# EAGLE design CAN_Wake_Up (EAGLE 9.1.1)
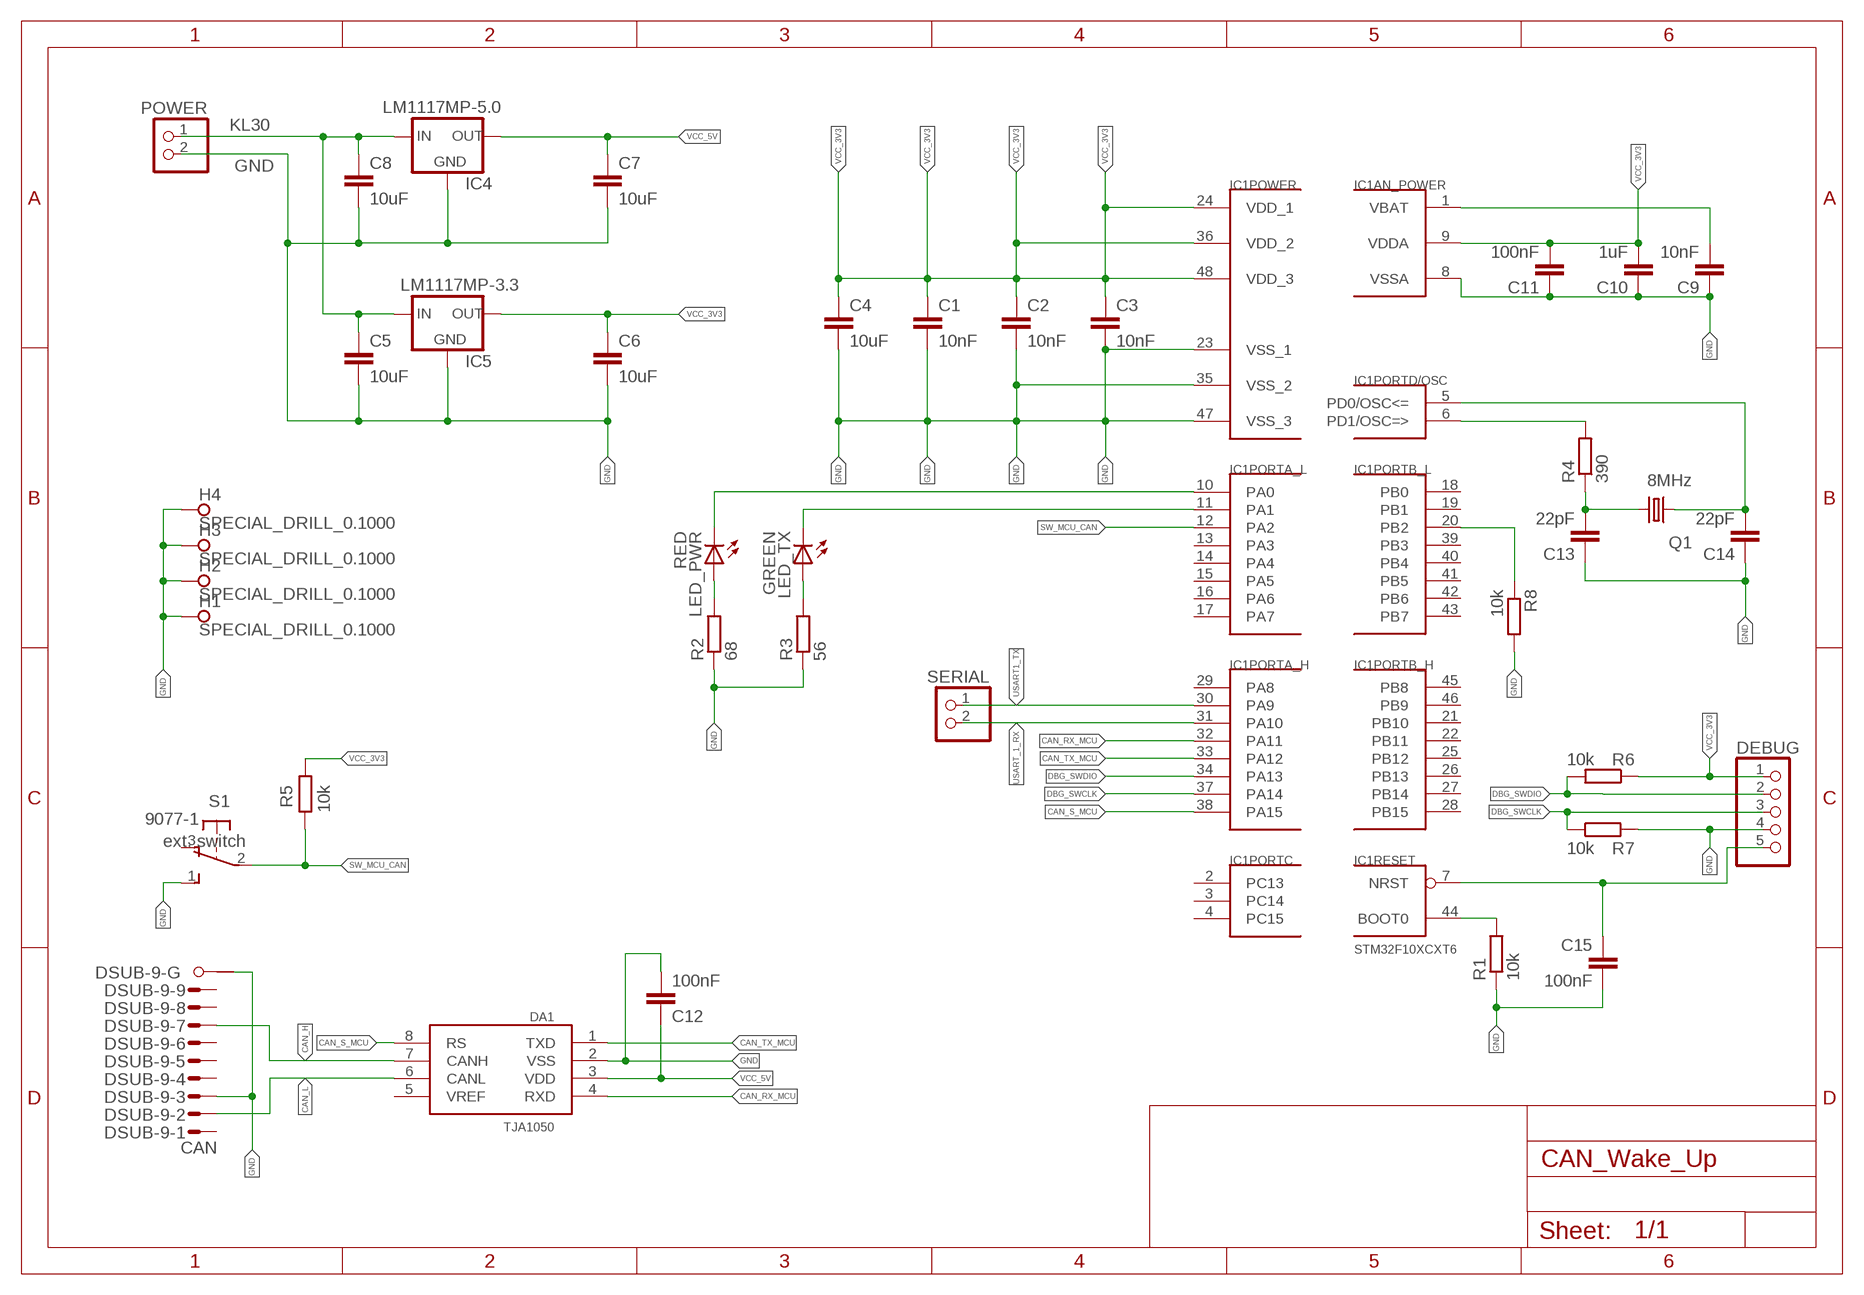
[diagram p0: schematic, sheet 1]

## Parts
C1  10nF  C-EUC0805  [C0805]
C2  10nF  C-EUC0805  [C0805]
C3  10nF  C-EUC0805  [C0805]
C4  10uF  C-EUC0805  [C0805]
C5  10uF  C-EUC0805  [C0805]
C6  10uF  C-EUC0805  [C0805]
C7  10uF  C-EUC0805  [C0805]
C8  10uF  C-EUC0805  [C0805]
C9  10nF  C-EUC0805  [C0805]
C10  1uF  C-EUC0805  [C0805]
C11  100nF  C-EUC0805  [C0805]
C12  100nF  C-EUC0805  [C0805]
C13  22pF  C-EUC0805  [C0805]
C14  22pF  C-EUC0805  [C0805]
C15  100nF  C-EUC0805  [C0805]
DA1  TJA1050  [SO08]
DEBUG  PINHD-1X5  [1X05]
DSUB-9  CAN  M09HPS  [M09HP]
H1  SPECIAL_DRILL_0.1000  [PAD_0.1000]
H2  SPECIAL_DRILL_0.1000  [PAD_0.1000]
H3  SPECIAL_DRILL_0.1000  [PAD_0.1000]
H4  SPECIAL_DRILL_0.1000  [PAD_0.1000]
IC1  STM32F10XCXT6  [TQFP48]
IC4  LM1117MP-5.0  [SOT223]
IC5  LM1117MP-3.3  [SOT223]
LED_PWR  RED  LEDSML0805  [SML0805]
LED_TX  GREEN  LEDSML0805  [SML0805]
POWER  PINHD-1X2  [1X02]
Q1  8MHz  CRYSTALHC49UP  [HC49UP]
R1  10k  R-EU_R0805  [R0805]
R2  68  R-EU_R0805  [R0805]
R3  56  R-EU_R0805  [R0805]
R4  390  R-EU_R0805  [R0805]
R5  10k  R-EU_R0805  [R0805]
R6  10k  R-EU_R0805  [R0805]
R7  10k  R-EU_R0805  [R0805]
R8  10k  R-EU_R0805  [R0805]
S1  9077-1  [9077-1]
SERIAL  PINHD-1X2  [1X02]

## Nets
CAN_H: DA1.7(CANH) DSUB-9.7(-7:M)
CAN_L: DA1.6(CANL) DSUB-9.2(-2:M)
CAN_RX_MCU: DA1.4(RXD) IC1.32(PORTA_H:PA11)
CAN_S_MCU: DA1.8(RS) IC1.38(PORTA_H:PA15)
CAN_TX_MCU: DA1.1(TXD) IC1.33(PORTA_H:PA12)
DBG_SWCLK: DEBUG.3 IC1.37(PORTA_H:PA14) R7.1
DBG_SWDIO: DEBUG.2 IC1.34(PORTA_H:PA13) R6.2
GND: C1.2 C2.2 C3.2 C4.2 C5.2 C6.2 C7.2 C8.2 C9.1 C10.1 C11.1 C12.2 C13.1 C14.1 C15.2 DA1.2(VSS) DEBUG.4 DSUB-9.3(-3:M) DSUB-9.G1(-G:G1) H1.1 H2.1 H3.1 H4.1 IC1.8(AN_POWER:VSSA) IC1.23(POWER:VSS_1) IC1.35(POWER:VSS_2) IC1.47(POWER:VSS_3) IC4.1(GND) IC5.1(GND) POWER.2 R1.1 R2.1 R3.1 R7.2 R8.2 S1.1(S)
KL30: C5.1 C8.1 IC4.3(IN) IC5.3(IN) POWER.1
LED_MCU_CAN: IC1.11(PORTA_L:PA1) LED_TX.C
LED_MCU_PWR: IC1.10(PORTA_L:PA0) LED_PWR.C
N$1: IC1.44(RESET:BOOT0) R1.2
N$2: C9.2 IC1.1(AN_POWER:VBAT)
N$3: LED_PWR.A R2.2
N$4: LED_TX.A R3.2
N$5: C13.2 Q1.2 R4.1
N$6: C14.2 IC1.5(PORTD/OSC:PD0/OSC<=) Q1.1
N$7: IC1.6(PORTD/OSC:PD1/OSC=>) R4.2
N$8: IC1.20(PORTB_L:PB2) R8.1
N$9: C15.1 DEBUG.5 IC1.7(RESET:NRST)
SW_MCU_CAN: IC1.12(PORTA_L:PA2) R5.1 S1.2(P)
USART1_TX: IC1.30(PORTA_H:PA9) SERIAL.1
USART_1_RX: IC1.31(PORTA_H:PA10) SERIAL.2
VCC_3V3: C1.1 C2.1 C3.1 C4.1 C6.1 C10.2 C11.2 DEBUG.1 IC1.9(AN_POWER:VDDA) IC1.24(POWER:VDD_1) IC1.36(POWER:VDD_2) IC1.48(POWER:VDD_3) IC5.2(OUT) IC5.4(OUT) R5.2 R6.1
VCC_5V: C7.1 C12.1 DA1.3(VDD) IC4.2(OUT) IC4.4(OUT)
Unconnected: DA1.5(VREF) DSUB-9.1(-1:M) DSUB-9.4(-4:M) DSUB-9.5(-5:M) DSUB-9.6(-6:M) DSUB-9.8(-8:M) DSUB-9.9(-9:M) DSUB-9.G2(-G:G2) IC1.2(PORTC:PC13) IC1.3(PORTC:PC14) IC1.4(PORTC:PC15) IC1.13(PORTA_L:PA3) IC1.14(PORTA_L:PA4) IC1.15(PORTA_L:PA5) IC1.16(PORTA_L:PA6) IC1.17(PORTA_L:PA7) IC1.18(PORTB_L:PB0) IC1.19(PORTB_L:PB1) IC1.21(PORTB_H:PB10) IC1.22(PORTB_H:PB11) IC1.25(PORTB_H:PB12) IC1.26(PORTB_H:PB13) IC1.27(PORTB_H:PB14) IC1.28(PORTB_H:PB15) IC1.29(PORTA_H:PA8) IC1.39(PORTB_L:PB3) IC1.40(PORTB_L:PB4) IC1.41(PORTB_L:PB5) IC1.42(PORTB_L:PB6) IC1.43(PORTB_L:PB7) IC1.45(PORTB_H:PB8) IC1.46(PORTB_H:PB9) S1.3(O)

## Notes on the sheet
- ext. switch

## Library data of the parts
C1-C15 = rcl:C-EU: CAPACITOR, European symbol
DA1 = CAN_Driver:TJA1050: High speed CAN transceiver Input levels compatible with 3.3 V and 5 V devices 5V supply
DEBUG = pinhead:PINHD-1X5: PIN HEADER
DSUB-9 = con-subd:M09HPS: SUB-D; OC_FARNELL: unknown; OC_NEWARK: unknown
H1-H4 = special-drill:SPECIAL_DRILL_: Special drills
IC1 = stm32:STM32F10XCXT6: ST STM32F101/103 48pin LQFP
IC4 = lm1117_11:LM1117?-*: 800mA Low-Dropout Linear Regulator Source: http://www.ti.com/lit/ds/symlink/lm1117-n.pdf; MF: Texas Instruments; MPN: LM1117MP-5.0; OC_FARNELL: 9778209; OC_NEWARK: 28X3417
IC5 = lm1117_11:LM1117?-*: 800mA Low-Dropout Linear Regulator Source: http://www.ti.com/lit/ds/symlink/lm1117-n.pdf; MF: Texas Instruments; MPN: LM1117MP-3.3; OC_FARNELL: 9778195; OC_NEWARK: 28X3416
LED_PWR LED_TX = led:LED: LED OSRAM: - CHIPLED LG R971, LG N971, LY N971, LG Q971, LY Q971, LO R971, LY R971 LH N974, LH R974 LS Q976, LO Q976, LY Q976 LO Q996 - Hyper CHIPLED LW Q18S LB Q993, LB Q99A, LB R99A - SideLED LS A670, LO A670, LY A670, LG A670, LP A670 LB A673, LV A673, LT A673, LW A673 LH A674 LY A675 LS A676, LA A676, LO A676, LY A676, LW A676 LS A679, LY A679, LG A679 - Hyper Micro SIDELED® LS Y876, LA Y876, LO Y876, LY Y876 LT Y87S - SmartLED LW L88C, LW L88S LB L89C, LB L89S, LG L890 LS L89K, LO L89K, LY L89K LS L896, LA L896, LO L896, LY L896 - TOPLED LS T670, LO T670, LY T670, LG T670, LP T670 LSG T670, LSP T670, LSY T670, LOP T670, LYG T670 LG T671, LOG T671, LSG T671 LB T673, LV T673, LT T673, LW T673 LH T674 LS T676, LA T676, LO T676, LY T676, LB T676, LH T676, LSB T676, LW T676 LB T67C, LV T67C, LT T67C, LS T67K, LO T67K, LY T67K, LW E67C LS E67B, LA E67B, LO E67B, LY E67B, LB E67C, LV E67C, LT E67C LW T67C LS T679, LY T679, LG T679 LS T770, LO T770, LY T770, LG T770, LP T770 LB T773, LV T773, LT T773, LW T773 LH T774 LS E675, LA E675, LY E675, LS T675 LS T776, LA T776, LO T776, LY T776, LB T776 LHGB T686 LT T68C, LB T68C - Hyper Mini TOPLED® LB M676 - Mini TOPLED Santana® LG M470 LS M47K, LO M47K, LY M47K Source: http://www.osram.convergy.de LUXEON: - LUMILED® LXK2-PW12-R00, LXK2-PW12-S00, LXK2-PW14-U00, LXK2-PW14-V00 LXK2-PM12-R00, LXK2-PM12-S00, LXK2-PM14-U00 LXK2-PE12-Q00, LXK2-PE12-R00, LXK2-PE12-S00, LXK2-PE14-T00, LXK2-PE14-U00 LXK2-PB12-K00, LXK2-PB12-L00, LXK2-PB12-M00, LXK2-PB14-N00, LXK2-PB14-P00, LXK2-PB14-Q00 LXK2-PR12-L00, LXK2-PR12-M00, LXK2-PR14-Q00, LXK2-PR14-R00 LXK2-PD12-Q00, LXK2-PD12-R00, LXK2-PD12-S00 LXK2-PH12-R00, LXK2-PH12-S00 LXK2-PL12-P00, LXK2-PL12-Q00, LXK2-PL12-R00 Source: www.luxeon.com KINGBRIGHT: KA-3528ASYC Source: www.kingbright.com
POWER SERIAL = pinhead:PINHD-1X2: PIN HEADER
Q1 = crystal:CRYSTAL: CRYSTAL; OC_FARNELL: unknown; OC_NEWARK: unknown
R1-R8 = rcl:R-EU_: RESISTOR, European symbol
S1 = switch-misc:9077-1: MARQUARDT SWITCH 9077.0100 Distributor: Buerklin <https://www.buerklin.com/default.asp?event=ShowArtikel%2812G2820%29&l=d&jump=ArtNr_12G2820>

## Board
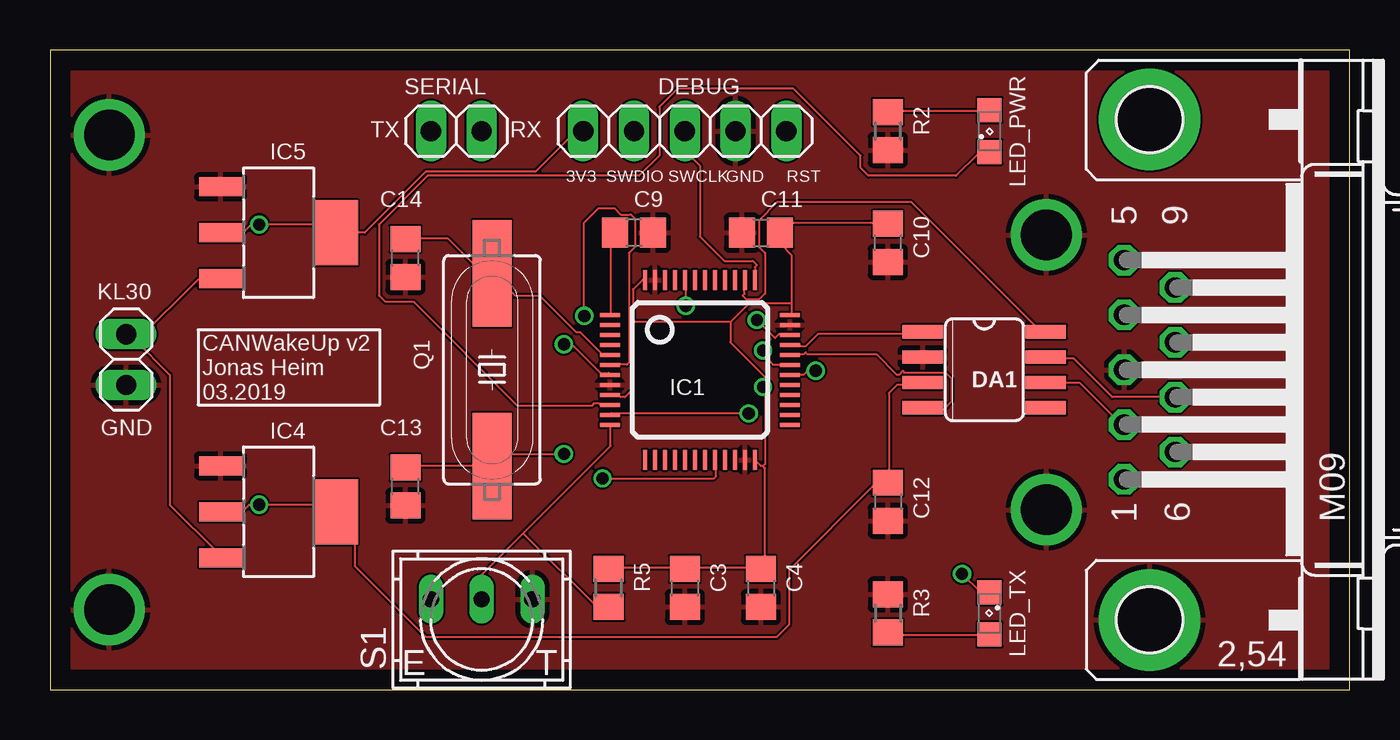
[diagram p1: board, top side]
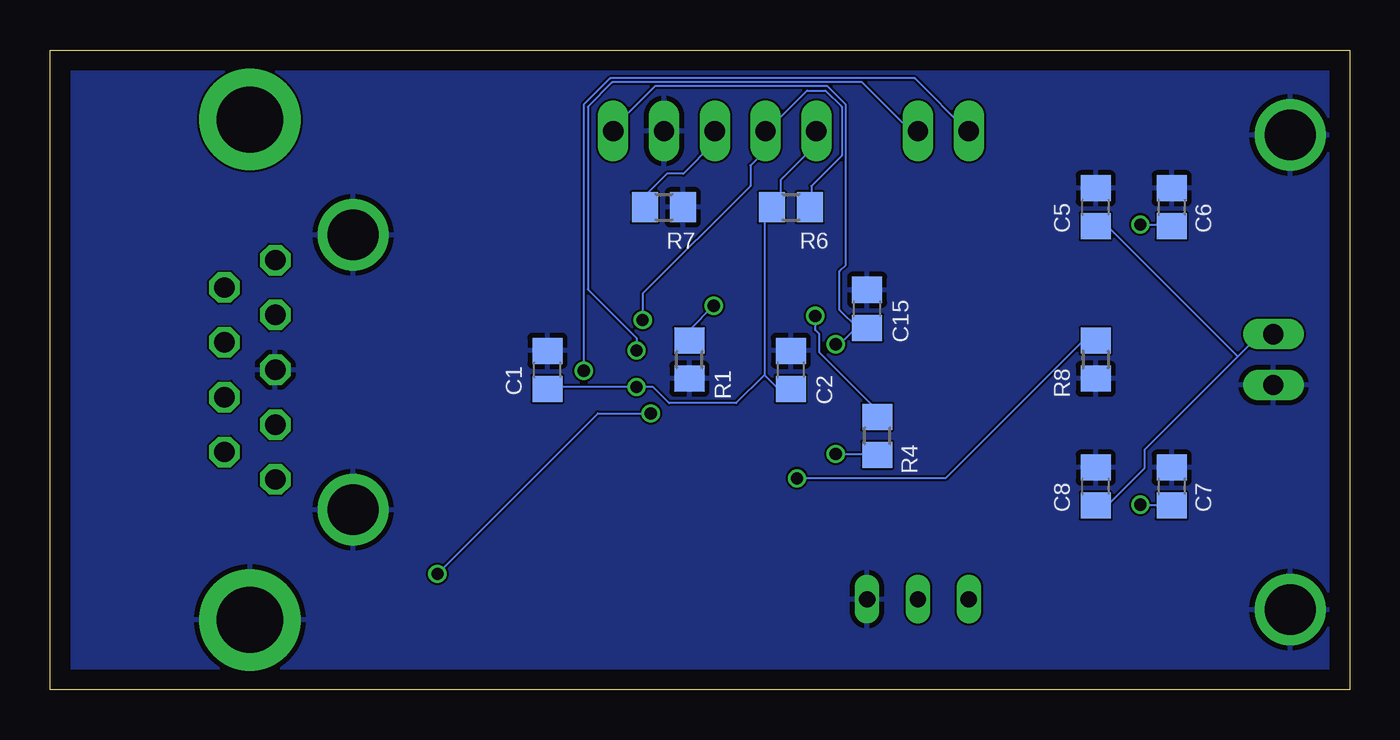
[diagram p2: board, bottom side, seen from below]

Size 65 x 32 mm. Coordinates in mm from the lower left corner, seen from the top.
Outline: 0,0 65,0 65,32 0,32 0,0
Copper layers (1*16): Top 0.035mm / dielectric 1.5mm / Bottom 0.035mm
Design rules "default *": minimum track width 4mil, minimum drill 24mil, track to track 4mil, track to pad 4mil, pad to pad 4mil, via to via 12mil, smd to smd 8mil, copper to edge 40mil, drill to drill 8mil, minimum pad ring 6mil, minimum via ring 6mil, stop-mask expansion 4mil, vias tented up to drill 0mil, thermal gap 10mil

### Footprints (pad centres in the part's own frame; a part is rotated, then mirrored left to right if it is on the bottom)
C0805 = smd 1.3 x 1.5: 1 -0.95,0; 2 0.95,0
SO08 = smd 0.66 x 2.032: 1 -1.905,-3.073; 2 -0.635,-3.073; 3 0.635,-3.073; 4 1.905,-3.073; 5 1.905,3.073; 6 0.635,3.073; 7 -0.635,3.073; 8 -1.905,3.073
1X05 = drill 1.016 long: 1 -5.08,0; 2 -2.54,0; 3 0,0; 4 2.54,0; 5 5.08,0
M09HP = drill 1.016 octagon: 1 -5.486,1.27; 2 -2.743,1.27; 3 0,1.27; 4 2.743,1.27; 5 5.486,1.27; 6 -4.115,-1.27; 7 -1.372,-1.27; 8 1.372,-1.27; 9 4.115,-1.27 | drill 3.302 pad 5.08: G1 -12.522,0; G2 12.522,0
PAD_0.1000 = drill 2.54 pad 2.54: 1 0,0
TQFP48 = smd 0.2 x 1: 1 -2.75,-4.5; 2 -2.25,-4.5; 3 -1.75,-4.5; 4 -1.25,-4.5; 5 -0.75,-4.5; 6 -0.25,-4.5; 7 0.25,-4.5; 8 0.75,-4.5; 9 1.25,-4.5; 10 1.75,-4.5; 11 2.25,-4.5; 12 2.75,-4.5; 25 2.75,4.5; 26 2.25,4.5; 27 1.75,4.5; 28 1.25,4.5; 29 0.75,4.5; 30 0.25,4.5; 31 -0.25,4.5; 32 -0.75,4.5; 33 -1.25,4.5; 34 -1.75,4.5; 35 -2.25,4.5; 36 -2.75,4.5 | smd 1 x 0.2: 13 4.5,-2.75; 14 4.5,-2.25; 15 4.5,-1.75; 16 4.5,-1.25; 17 4.5,-0.75; 18 4.5,-0.25; 19 4.5,0.25; 20 4.5,0.75; 21 4.5,1.25; 22 4.5,1.75; 23 4.5,2.25; 24 4.5,2.75; 37 -4.5,2.75; 38 -4.5,2.25; 39 -4.5,1.75; 40 -4.5,1.25; 41 -4.5,0.75; 42 -4.5,0.25; 43 -4.5,-0.25; 44 -4.5,-0.75; 45 -4.5,-1.25; 46 -4.5,-1.75; 47 -4.5,-2.25; 48 -4.5,-2.75
SOT223 = smd 0.95 x 2.15: 1 -2.3,-2.9; 2 0,-2.9; 3 2.3,-2.9 | smd 3.25 x 2.15: 4 0,2.9
SML0805 = smd 1.2 x 1.2: A 1.05,0; C -1.05,0
1X02 = drill 1.016 long: 1 -1.27,0; 2 1.27,0
HC49UP = smd 5.334 x 1.93: 1 -4.826,0; 2 4.826,0
R0805 = smd 1.3 x 1.5: 1 -0.95,0; 2 0.95,0
9077-1 = drill 0.813 long: 1 -2.54,-1.016; 2 0,-1.016; 3 2.54,-1.016

### Placement (x,y rotation side)
C1  40.12,16 90 bottom
C2  27.94,16 90 bottom
C3  31.75,5.08 270 top
C4  35.56,5.08 270 top
C5  12.7,24.13 90 bottom
C6  8.89,24.13 90 bottom
C7  8.89,10.16 90 bottom
C8  12.7,10.16 90 bottom
C9  29.21,22.86 180 top
C10  41.91,22.35 90 top
C11  35.56,22.86 0 top
C12  41.91,9.4 270 top
C13  17.78,10.16 90 top
C14  17.78,21.59 90 top
C15  24.13,19.05 90 bottom
DA1  46.73,16 270 top
DEBUG  31.75,27.94 0 top
DSUB-9  55,16 90 top
H1  2.97,27.75 0 top
H2  2.97,4 0 top
H3  49.84,9 0 top
H4  49.84,22.75 0 top
IC1  32.5,16 270 top
IC4  11.43,8.89 270 top
IC5  11.43,22.86 270 top
LED_PWR  46.99,27.94 90 top
LED_TX  46.99,3.81 270 top
POWER  3.81,16.51 270 top
Q1  22.11,16 270 top
R1  33.02,16.51 90 bottom
R2  41.91,27.94 90 top
R3  41.91,3.81 270 top
R4  23.62,12.7 90 bottom
R5  27.94,5.08 90 top
R6  27.94,24.13 0 bottom
R7  34.29,24.13 0 bottom
R8  12.7,16.51 270 bottom
S1  21.59,3.5 180 top
SERIAL  20.32,27.94 0 top

### Tracks (layer width: path | path; a pad name or v marks a point on that pad's centre or on a via)
CAN_H
  Top 0.102: DA1.7 49.89,16.56 51.21,16.56 53.14,14.63 56.19,14.63 DSUB-9.7
CAN_L
  Top 0.102: DA1.6 49.89,15.34 51.51,15.34 53.65,13.21 DSUB-9.2
CAN_RX_MCU
  Top 0.102: IC1.32 37.08,16.76 37.69,16.76 37.8,16.87 37.9,16.76 41.35,16.76 42.37,15.75 42.47,15.75 42.67,15.95 42.77,15.85 44.81,15.85 45.11,15.54 45.11,14.43 44.7,14.02 43.69,14.02 DA1.4
CAN_S_MCU
  Top 0.102: IC1.38 34.75,20.42 34.75,19.81 34.65,19.71 34.85,19.51 35.46,19.51 35.76,19.81 35.76,21.84 35.46,22.15 35.46,23.47 36.37,24.38 43.08,24.38 49.48,17.98 49.78,17.98 DA1.8
CAN_TX_MCU
  Top 0.102: IC1.33 37.08,17.27 37.49,17.27 37.59,17.17 37.8,17.17 38.41,17.78 43.48,17.78 43.59,17.88 DA1.1
DBG_SWCLK
  Top 0.102: IC1.37 35.26,20.52 35.26,21.13 35.36,21.23 35.15,21.44 33.73,21.44 32.51,22.66 32.51,26.21 31.8,26.92 31.8,27.94 DEBUG.3
  Bottom 0.102: R7.1 35.15,24.18 35.15,24.79 34.14,25.81 33.33,25.81 31.8,27.33 31.8,27.94 DEBUG.3
DBG_SWDIO  (via drill 0.61)
  Top 0.102: v35.36,18.49 36.27,17.58 36.47,17.78 36.98,17.78 IC1.34
  Bottom 0.102: v35.36,18.49 35.36,19.81 29.97,25.2 29.97,26.21 29.26,26.92 29.26,27.94 DEBUG.2 29.16,27.94 27.13,29.97 26.21,29.97 25.4,29.16 25.4,26.72 26.92,25.2 26.92,24.18 R6.2
GND
  pour Bottom: 64.77,0 0,0 0,31.75 64.77,31.75
  pour Top: 0,31.75 0,0 64.77,0 64.77,31.75
KL30
  Top 0.102: 4.27,17.48 3.96,17.78 3.86,17.78 POWER.1 4.27,17.48 | 4.27,17.48 5.99,15.75 5.99,9.25 8.43,6.81 8.43,6.6 IC4.3 | 4.27,17.48 4.37,17.48 7.42,20.52 8.43,20.52 IC5.3
  Bottom 0.102: 5.59,16.66 4.47,17.78 3.86,17.78 POWER.1 | 5.59,16.66 10.26,11.99 10.26,11.07 12.09,9.25 12.7,9.25 C8.1 | 5.59,16.66 12.09,23.16 12.7,23.16 C5.1
LED_MCU_CAN  (via drill 0.61)
  Top 0.102: v34.95,13.82 28.04,13.82 IC1.11 | v45.62,5.79 46.53,4.88 46.94,4.88 LED_TX.C
  Bottom 0.102: v34.95,13.82 37.59,13.82 v45.62,5.79
LED_MCU_PWR
  Top 0.102: IC1.10 27.94,14.22 27.53,14.22 27.43,14.33 27.23,14.33 27.13,14.22 23.37,14.22 18.19,19.41 16.76,19.41 16.46,19.71 16.46,23.27 18.9,25.7 29.46,25.7 30.48,26.72 30.48,29.16 31.39,30.07 37.19,30.07 40.54,26.72 40.54,26.11 40.95,25.7 45.31,25.7 46.43,26.82 46.94,26.82 LED_PWR.C
N$1  (via drill 0.61)
  Top 0.102: v31.8,19.2 31.8,20.42 IC1.44
  Bottom 0.102: v31.8,19.2 33.02,17.98 33.02,17.48 R1.2
N$2
  Top 0.102: IC1.1 28.04,18.8 28.04,22.66 28.25,22.86 C9.2
N$3
  Top 0.102: LED_PWR.A 46.94,28.96 41.96,28.96 R2.2
N$4
  Top 0.102: LED_TX.A 46.94,2.74 42.06,2.74 41.96,2.85 R3.2
N$5  (via drill 0.61)
  Top 0.102: C13.2 17.78,11.18 22.05,11.18 Q1.2 22.15,11.18 22.76,11.79 v25.7,11.79
  Bottom 0.102: v25.7,11.79 23.67,11.79 R4.1
N$6
  Top 0.102: IC1.5 27.94,16.76 27.64,16.76 26.52,17.88 26.31,17.88 24.49,19.71 23.27,19.71 22.15,20.83 Q1.1 22.05,20.83 21.64,20.83 19.91,22.55 17.78,22.55 C14.2
N$7  (via drill 0.61)
  Top 0.102: v26.72,18.69 26.72,23.37 27.43,24.08 28.25,24.08 28.55,23.77 29.06,23.77 29.26,23.57 29.26,22.15 28.96,21.84 28.96,16.36 28.85,16.26 28.04,16.26 IC1.6
  Bottom 0.102: v26.72,18.69 26.72,17.98 26.52,17.78 26.52,16.87 23.67,14.02 23.67,13.72 R4.2
N$8  (via drill 0.61)
  Top 0.102: v27.64,10.57 33.22,10.57 33.33,10.67 33.33,11.48 IC1.20
  Bottom 0.102: v27.64,10.57 20.22,10.57 13.41,17.37 12.7,17.37 R8.1
N$9  (via drill 0.61)
  Top 0.102: v25.7,17.27 26.11,17.27 27.53,15.85 27.94,15.85 IC1.7
  Bottom 0.102: v25.7,17.27 25.5,17.27 24.69,18.09 24.59,18.09 | 24.59,18.09 24.18,18.09 C15.1 24.59,18.09 | 24.59,18.09 25.5,19 25.5,20.93 25.2,21.23 25.2,29.26 26.11,30.18 34.75,30.18 36.78,28.14 36.78,27.94 DEBUG.5
SW_MCU_CAN
  Top 0.102: 23.67,7.82 21.54,5.69 21.54,4.57 S1.2 | 23.67,7.82 28.04,12.19 28.04,13.21 IC1.12 | 23.67,7.82 27.33,4.17 27.94,4.17 R5.1
USART1_TX  (via drill 0.61)
  Top 0.102: v38.3,15.95 38.2,16.05 38,16.05 37.69,15.75 37.08,15.75 IC1.30
  Bottom 0.102: v38.3,15.95 38.3,29.26 36.98,30.58 21.74,30.58 19.1,27.94 SERIAL.1
USART_1_RX  (via drill 0.61)
  Top 0.102: v35.66,16.97 35.66,16.76 36.17,16.26 36.98,16.26 IC1.31
  Bottom 0.102: v35.66,16.97 35.66,17.58 38.1,20.02 38.1,29.16 36.88,30.38 24.38,30.38 21.95,27.94 21.64,27.94 SERIAL.2
VCC_3V3  (via drill 0.61)
  Top 0.102: R5.2 27.94,6.1 31.7,6.1 C3.1 31.8,6.1 35.56,6.1 | 35.66,11.18 35.56,11.18 35.26,11.48 IC1.24 | 35.66,11.18 35.76,11.07 35.76,6.3 35.56,6.1 | 35.56,6.1 C4.1 35.56,6.1 | 29.16,18.39 29.16,20.02 29.67,20.52 IC1.48 | 29.16,18.39 29.16,15.04 28.75,14.63 28.55,14.63 28.45,14.73 28.04,14.73 IC1.9 | 37.08,19.3 37.08,21.74 36.58,22.25 36.58,22.86 | 37.08,19.3 37.08,18.8 IC1.36 | 36.58,22.86 C11.2 36.58,22.86 | 36.58,22.86 37.08,23.37 41.86,23.37 C10.2 | 34.04,18.39 29.16,18.39 | 34.04,18.39 34.95,19.3 37.08,19.3 | 35.66,11.18 35.76,11.28 35.76,15.14 | 35.76,15.14 35.76,15.65 34.04,17.37 34.04,18.39 | IC5.2 9.65,22.86 10.06,23.27 v10.46,23.27 13.92,23.27 IC5.4 14.43,22.86 15.75,22.86 18.8,25.91 24.28,25.91 26.31,27.94 26.62,27.94 DEBUG.1 | v35.66,15.14 35.76,15.14
  Bottom 0.102: v10.46,23.27 8.94,23.27 C6.1 | 29.26,15.75 28.65,15.14 27.94,15.14 C2.1 | 29.26,15.75 29.26,23.77 28.96,24.08 R6.1 28.85,24.18 28.45,24.59 28.45,25.5 26.72,27.23 26.72,27.94 DEBUG.1 | 29.26,15.75 30.68,14.33 34.04,14.33 34.85,15.14 v35.66,15.14 40.03,15.14 C1.1
VCC_5V  (via drill 0.61)
  Top 0.102: DA1.3 43.59,15.34 43.48,15.24 42.37,15.24 41.96,14.83 41.96,10.36 C12.1 41.86,10.26 41.25,10.26 36.98,5.99 36.98,3.25 36.37,2.64 18.8,2.64 15.24,6.2 15.24,8.03 14.43,8.84 IC4.4 14.33,8.94 14.02,9.25 v10.46,9.25 9.96,9.25 9.65,8.94 8.53,8.94 IC4.2
  Bottom 0.102: v10.46,9.25 8.94,9.25 C7.1

### Text on the board
tNames: TX | RX | 3V3 | SWDIO | SWCLK | GND | RST | KL30 | CANWakeUp v2 / Jonas Heim / 03.2019 | GND